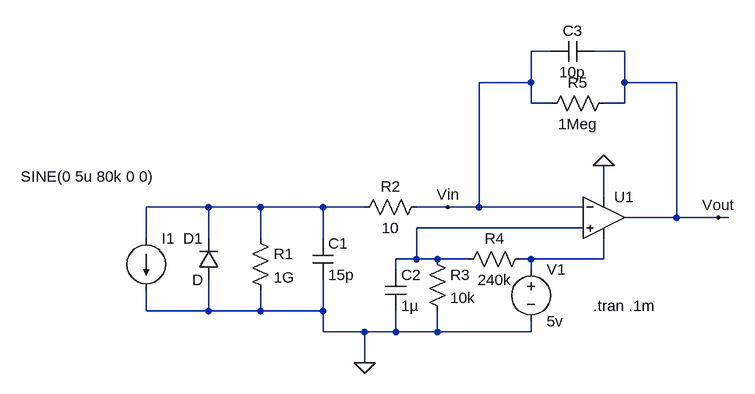
[diagram p0: schematic Draft8.asc]
Draft8.asc, the LTspice schematic file:
Version 4
SHEET 1 880 680
WIRE 544 32 512 32
WIRE 656 32 608 32
WIRE 512 80 512 32
WIRE 512 80 432 80
WIRE 656 80 656 32
WIRE 736 80 656 80
WIRE 512 112 512 80
WIRE 544 112 512 112
WIRE 656 112 656 80
WIRE 656 112 624 112
WIRE 624 256 624 208
WIRE 16 272 -80 272
WIRE 96 272 16 272
WIRE 192 272 96 272
WIRE 256 272 192 272
WIRE 384 272 336 272
WIRE 432 272 432 80
WIRE 432 272 384 272
WIRE 592 272 432 272
WIRE 736 288 736 80
WIRE 736 288 656 288
WIRE 800 288 736 288
WIRE 816 288 800 288
WIRE 592 304 336 304
WIRE -80 320 -80 272
WIRE 16 320 16 272
WIRE 96 320 96 272
WIRE 192 320 192 272
WIRE 336 352 336 304
WIRE 336 352 304 352
WIRE 368 352 336 352
WIRE 416 352 368 352
WIRE 512 352 496 352
WIRE 624 352 624 320
WIRE 624 352 512 352
WIRE 304 368 304 352
WIRE 512 368 512 352
WIRE -80 432 -80 400
WIRE 16 432 16 384
WIRE 16 432 -80 432
WIRE 96 432 96 400
WIRE 96 432 16 432
WIRE 192 432 192 384
WIRE 192 432 96 432
WIRE 192 464 192 432
WIRE 256 464 192 464
WIRE 304 464 304 432
WIRE 304 464 256 464
WIRE 368 464 368 432
WIRE 368 464 304 464
WIRE 512 464 512 448
WIRE 512 464 368 464
WIRE 256 512 256 464
FLAG 800 288 Vout
FLAG 384 272 Vin
FLAG 256 512 0
FLAG 624 208 0
SYMBOL OpAmps/UniversalOpAmp 624 288 R0
SYMATTR InstName U1
SYMBOL res 80 304 R0
SYMATTR InstName R1
SYMATTR Value 1G
SYMBOL cap 176 320 R0
SYMATTR InstName C1
SYMATTR Value 15p
SYMBOL res 352 256 R90
WINDOW 0 0 56 VBottom 2
WINDOW 3 32 56 VTop 2
SYMATTR InstName R2
SYMATTR Value 10
SYMBOL current -80 320 R0
WINDOW 3 -193 -95 Left 2
SYMATTR Value SINE(0 5u 80k 0 0)
SYMATTR InstName I1
SYMATTR Value2 AC 3u 0
SYMBOL diode 32 384 R180
WINDOW 0 24 64 Left 2
WINDOW 3 24 0 Left 2
SYMATTR InstName D1
SYMBOL Res 352 336 R0
SYMATTR InstName R3
SYMATTR Value 10k
SYMBOL Res 512 336 R90
WINDOW 0 0 56 VBottom 2
WINDOW 3 32 56 VTop 2
SYMATTR InstName R4
SYMATTR Value 240k
SYMBOL Cap 288 368 R0
SYMATTR InstName C2
SYMATTR Value 1µ
SYMBOL voltage 512 352 R0
SYMATTR InstName V1
SYMATTR Value 5v
SYMBOL Res 640 96 R90
WINDOW 0 0 56 VBottom 2
WINDOW 3 32 56 VTop 2
SYMATTR InstName R5
SYMATTR Value 1Meg
SYMBOL Cap 608 16 R90
WINDOW 0 0 32 VBottom 2
WINDOW 3 32 32 VTop 2
SYMATTR InstName C3
SYMATTR Value 10p
TEXT 608 424 Left 2 !.tran .1m

The netlist it stands for:
* Draft8.asc
XU1 N002 Vin 0 N003 Vout level1 Avol=1Meg GBW=10Meg Vos=0 En=0 Enk=0 In=0 Ink=0 Rin=500Meg  ; pins In+ In- V+ V- OUT
R1 N001 0 1G
C1 N001 0 15p
R2 Vin N001 10
I1 N001 0 SINE(0 5u 80k 0 0) AC 3u 0
D1 0 N001 D
R3 N002 0 10k
R4 N003 N002 240k
C2 N002 0 1µ
V1 N003 0 5v
R5 Vout Vin 1Meg
C3 Vout Vin 10p
.model D D
.lib standard.dio
.tran .1m
.lib UniversalOpAmp1.lib
.backanno
.end